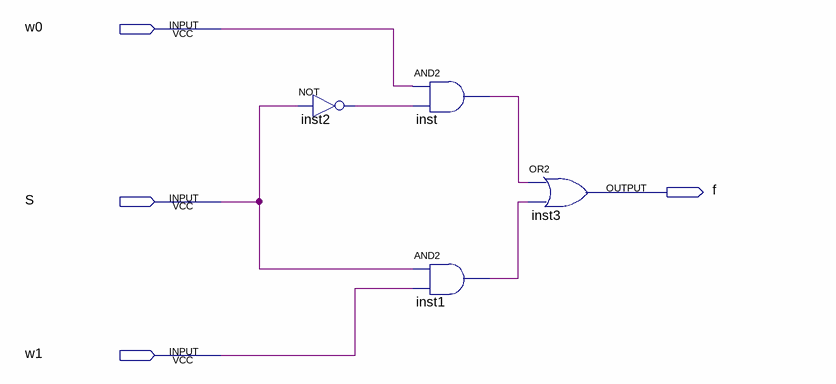
[diagram p0: schematic sheet]
// Quartus schematic multiplexador-2-1.bdf as structural Verilog: 4 symbols, 4 pins
module \multiplexador-2-1  (
  input  w0,
  input  S,
  input  w1,
  output f
);

  wire inst1_out, inst2_out, inst_out;

  not inst2 (inst2_out, S);
  and inst (inst_out, w0, inst2_out);
  and inst1 (inst1_out, S, w1);
  or inst3 (f, inst_out, inst1_out);
endmodule
